# EAGLE schematic Qwiic GPS - Titan X1 (EAGLE 7.7.0)
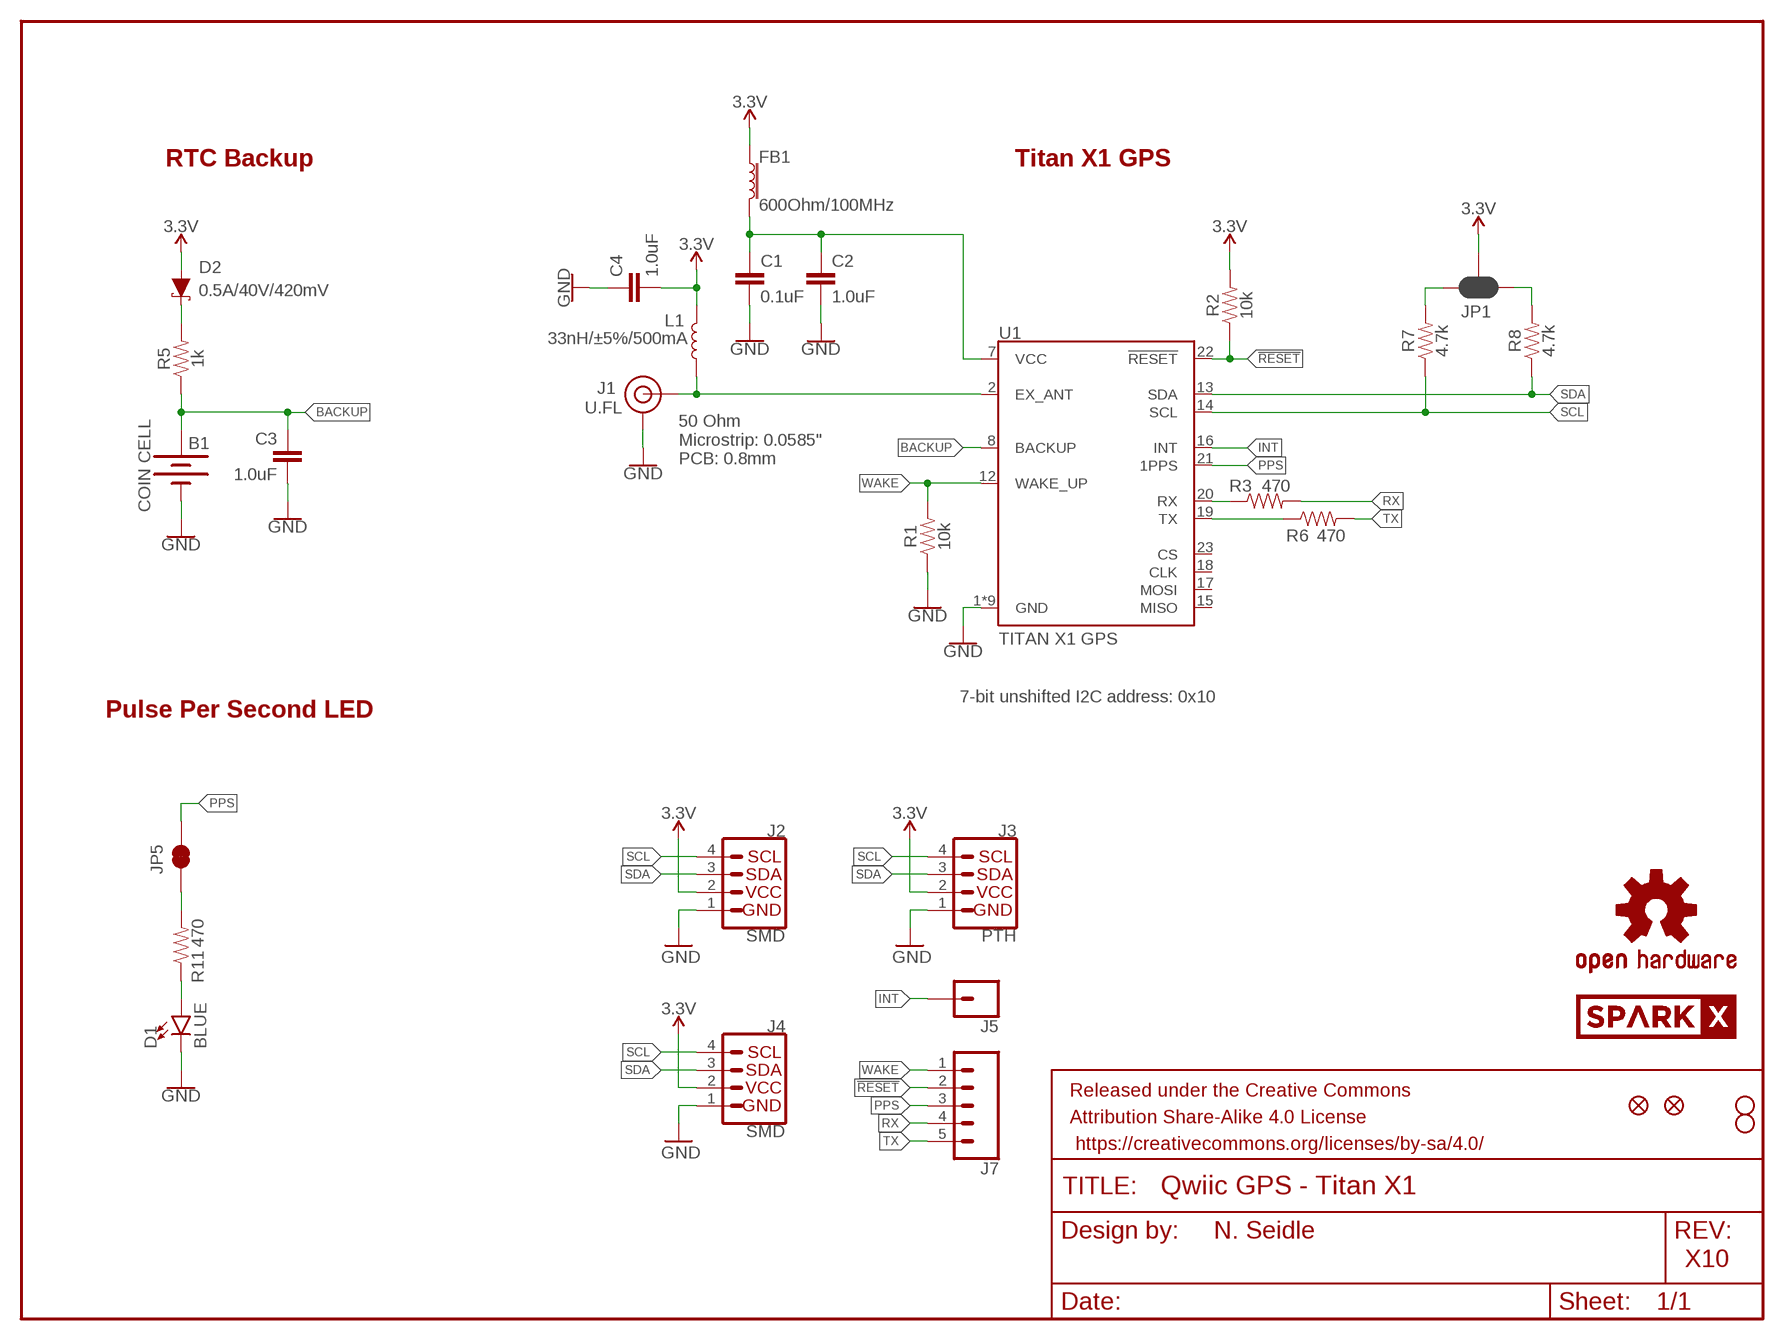
[diagram p0: schematic, sheet 1]

## Parts
B1  COIN CELL  6.8MM_COIN_CELL  [6.8MM_COIN_CELL]
C1  0.1uF  0.1UF-0603-25V-(+80/-20%)  [0603]
C2  1.0uF  1.0UF-0603-16V-10%  [0603]
C3  1.0uF  1.0UF-0603-16V-10%  [0603]
C4  1.0uF  1.0UF-0603-16V-10%  [0603]
D1  BLUE  LED-BLUE0603  [LED-0603]
D2  0.5A/40V/420mV  DIODE-SCHOTTKY-PMEG4005EJ  [SOD-323]
FB1  600Ohm/100MHz  FERRITE_BEAD-0603  [0603]
FRAME1  FRAME-LETTER  [CREATIVE_COMMONS]
J1  U.FL  [U.FL]
J2  SMD  I2C_STANDARDJS-1MM  [1X04_1MM_RA]
J3  PTH  I2C_STANDARD_NO_SILK  [1X04_NO_SILK]
J4  SMD  I2C_STANDARDJS-1MM  [1X04_1MM_RA]
J5  CONN_01PTH_NO_SILK_YES_STOP  [1X01_NO_SILK]
J7  CONN_05NO_SILK  [1X05_NO_SILK]
JP1  JUMPER-SMT_3_2-NC_PASTE_SILK  [SMT-JUMPER_3_2-NC_PASTE_SILK]
JP2  FIDUCIALUFIDUCIAL  [MICRO-FIDUCIAL]
JP3  STAND-OFF  [STAND-OFF]
JP4  STAND-OFF  [STAND-OFF]
JP5  JUMPER-SMT_2_NC_TRACE_NO-SILK  [SMT-JUMPER_2_NC_TRACE_NO-SILK]
JP6  FIDUCIALUFIDUCIAL  [MICRO-FIDUCIAL]
L1  33nH/±5%/500mA  INDUCTOR-0603-33NH  [0603]
LOGO1  OSHW-LOGOMINI  [OSHW-LOGO-MINI]
R1  10k  10KOHM-0603-1/10W-1%  [0603]
R2  10k  10KOHM-0603-1/10W-1%  [0603]
R3  470  470OHM-0603-1/10W-1%  [0603]
R5  1k  1KOHM-0603-1/10W-1%  [0603]
R6  470  470OHM-0603-1/10W-1%  [0603]
R7  4.7k  4.7KOHM-0603-1/10W-1%  [0603]
R8  4.7k  4.7KOHM-0603-1/10W-1%  [0603]
R11  470  470OHM-0603-1/10W-1%  [0603]
U1  TITAN X1 GPS  TITAN_X1_GPS  [TITAN_X1_GPS]
U$1  SPARKX-LOGO5  [SPARKX-LARGE]

## Nets
3.3V: C4.2 D2.A FB1.1 J2.2(VCC) J3.2(VCC) J4.2(VCC) JP1.2 L1.2 R2.2
!RESET: J7.2 R2.1 U1.22(!RESET)
BACKUP: B1.+ C3.1 R5.1 U1.8(BACKUP)
EXT_ANT: J1.FEED(SIGNAL) L1.1 U1.2(EX_ANT)
GND: B1.- C1.2 C2.2 C3.2 C4.1 D1.C J1.1(GND) J1.2(GND) J2.1(GND) J3.1(GND) J4.1(GND) R1.1 U1.1(GND) U1.3(GND) U1.4(GND) U1.5(GND) U1.6(GND) U1.9(GND) U1.10(GND) U1.11(GND) U1.24(GND)
INT: J5.1 U1.16(INT)
N$2: D1.A R11.1
N$4: JP5.1 R11.2
N$5: JP1.1 R8.2
N$6: D2.C R5.2
N$8: JP1.3 R7.2
PPS: J7.3 JP5.2 U1.21(1PPS)
RX: J7.4 R3.2
RXLV: R3.1 U1.20(RX)
SCL: J2.4(SCL) J3.4(SCL) J4.4(SCL) R7.1 U1.14(SCL)
SDA: J2.3(SDA) J3.3(SDA) J4.3(SDA) R8.1 U1.13(SDA)
TX: J7.5 R6.2
TXLV: R6.1 U1.19(TX)
VCC_FILTERED: C1.1 C2.1 FB1.2 U1.7(VCC)
WAKE: J7.1 R1.2 U1.12(WAKE_UP)
Unconnected: U1.15(MISO) U1.17(MOSI) U1.18(CLK) U1.23(CS)

## Notes on the sheet
- RTC Backup | Titan X1 GPS
- 50 Ohm 
  Microstrip: 0.0585"
  PCB: 0.8mm
- 7-bit unshifted I2C address: 0x10
- Pulse Per Second LED
- N. Seidle
- X10

## Library data of the parts
B1 = SparkX:6.8MM_COIN_CELL
C1 = SparkFun-Capacitors:0.1UF: 0.1µF ceramic capacitors A capacitor is a passive two-terminal electrical component used to store electrical energy temporarily in an electric field.; PROD_ID: CAP-00810
C2-C4 = SparkFun-Capacitors:1.0UF: 1µF ceramic capacitors A capacitor is a passive two-terminal electrical component used to store electrical energy temporarily in an electric field.; PROD_ID: CAP-00868
D1 = SparkFun-LED:LED-BLUE: Blue SMD LED Used in manufacturing of various products at SparkFun Packages: 0603 - SMD 0603 package [Product Link] <http://www.digikey.com/product-detail/en/SMLE12BC7TT86/511-1589-2-ND/1641808> 1206 - SMD1206 package [Product Link] <http://www.digikey.com/product-detail/en/lite-on-inc/LTST-C150TBKT/160-1643-1-ND/573584> SparkFun Products: ESP8266 Thing-Dev Board <https://www.sparkfun.com/products/13711> RedBoard <https://www.sparkfun.com/products/12757>; PROD_ID: DIO-08575
D2 = SparkFun-DiscreteSemi:DIODE-SCHOTTKY: Schottky diode A Schottky diode is a semiconductor diode which has a low forward voltage drop and a very fast switching action.; PROD_ID: DIO-10955
FB1 = SparkFun-Coils:FERRITE_BEAD: Ferrite Bead (blocks, cores, rings, chokes, etc.) Inductor with layers of ferrite used to suppress high frequencies. Often used to isolate high frequency noise. SparkFun Products: IOIO-OTG - V2.2 <https://www.sparkfun.com/products/13613> SparkFun SAMD21 Mini Breakout <https://www.sparkfun.com/products/13664> SparkFun 6 Degrees of Freedom Breakout - LSM6DS3 <https://www.sparkfun.com/products/13339> SparkFun SAMD21 Dev Breakout <https://www.sparkfun.com/products/13672>; PROD_ID: NDUC-07859; VALUE: 30Ω/1.8A
FRAME1 = SparkFun-Aesthetics:FRAME-LETTER: Schematic Frame - Letter Standard 8.5x11 US Letter frame
J1 = SparkX:U.FL: SMD Antenna Connector - U.FL 2mm height, 3.0mm x 3.0mm receptacle size. SparkFun Products: SparkFun WiFi Shield - ESP8266 <https://www.sparkfun.com/products/13287> SparkFun ESP8266 Thing <https://www.sparkfun.com/products/13231> SparkFun MiniGen - Pro Mini Signal Generator Shield <https://www.sparkfun.com/products/11420>; PROD_ID: CONN-09193; SF_ID: WRL-09144
J2-J4 = SparkX:I2C_STANDARD: SparkFun I2C Standard Pinout Header SparkFun has standardized on a pinout for all I2C based sensor breakouts. This pinout allows I2C boards to be plugged directly into the headers on Arduino Uno compatible boards, and to be daisy chained easily. Example SparkFun Products: SparkFun Atmospheric Sensor Breakout - BME280 <https://www.sparkfun.com/products/13676> SparkFun Altitude/Pressure Sensor Breakout - MPL3115A2 <https://www.sparkfun.com/products/11084> SparkFun TOF Range Finder Sensor - VL6180 <https://www.sparkfun.com/products/12785>
J5 = SparkFun-Connectors:CONN_01: Single connection point. Often used as Generic Header-pin footprint for 0.1 inch spaced/style header connections On any of the 0.1 inch spaced packages, you can populate with these: Break Away Headers - Straight <https://www.sparkfun.com/products/116> (PRT-00116) Break Away Male Headers - Right Angle <https://www.sparkfun.com/products/553> (PRT-00553) Female Headers <https://www.sparkfun.com/products/115> (PRT-00115) Break Away Headers - Machine Pin <https://www.sparkfun.com/products/117> (PRT-00117) Break Away Female Headers - Swiss Machine Pin <https://www.sparkfun.com/products/743> (PRT-00743) This device is also useful as a general connection point to wire up your design to another part of your project. Our various solder wires solder well into these plated through hole pads. Hook-Up Wire - Assortment (Stranded, 22 AWG) <https://www.sparkfun.com/products/11375> (PRT-11375) Hook-Up Wire - Assortment (Solid Core, 22 AWG) <https://www.sparkfun.com/products/11367> (PRT-11367) View the entire wire category on our website here <https://www.sparkfun.com/categories/141> Special notes: SMTSO-256-ET is a "flush mount" nut for a 4-40 screw. We mostly use this on specialty testbeds; it is a nice way to connect hardware to your PCB at an adjustable hieght. Also note, the SNAP packages are for using a snappable style connector. We sell a baggie of snaps and they are also used on two LilyPad designs: Snap Assortment - 30 pack (male and female) <https://www.sparkfun.com/products/11347> (DEV-11347) LilyPad Arduino SimpleSnap <https://www.sparkfun.com/products/10941> (DEV-10941) LilyPad SimpleSnap Protoboard <https://www.sparkfun.com/products/10940> (DEV-10940)
J7 = SparkFun-Connectors:CONN_05: Multi connection point. Often used as Generic Header-pin footprint for 0.1 inch spaced/style header connections On any of the 0.1 inch spaced packages, you can populate with these: Break Away Headers - Straight <https://www.sparkfun.com/products/116> (PRT-00116) Break Away Male Headers - Right Angle <https://www.sparkfun.com/products/553> (PRT-00553) Female Headers <https://www.sparkfun.com/products/115> (PRT-00115) Break Away Headers - Machine Pin <https://www.sparkfun.com/products/117> (PRT-00117) Break Away Female Headers - Swiss Machine Pin <https://www.sparkfun.com/products/743> (PRT-00743) For SCREWTERMINALS and SPRING TERMINALS visit here: Screw Terimnals on SparkFun.com <https://www.sparkfun.com/search/results?term=Screw+Terminals> (5mm/3.5mm/2.54mm spacing) This device is also useful as a general connection point to wire up your design to another part of your project. Our various solder wires solder well into these plated through hole pads. Hook-Up Wire - Assortment (Stranded, 22 AWG) <https://www.sparkfun.com/products/11375> (PRT-11375) Hook-Up Wire - Assortment (Solid Core, 22 AWG) <https://www.sparkfun.com/products/11367> (PRT-11367) View the entire wire category on our website here <https://www.sparkfun.com/categories/141> Special notes: Molex polarized connector foot print use with SKU : PRT-08231 with associated crimp pins and housings. 1MM SMD Version SKU: PRT-10208
JP1 = SparkFun-Jumpers:JUMPER-SMT_3_2-NC_PASTE: Normally closed solder jumper (2 of 2 connections) This jumper has an aperture in the stencil to allow solder paste to bridge both connections. Both connections are normally closed (NC). Wick off the solder to open the connection(s). Reapply solder to reclose the connection(s).
JP2 JP6 = SparkFun:FIDUCIAL: Fiducial Alignment Points Various fiducial points for machine vision alignment.
JP3 JP4 = SparkFun:STAND-OFF: Stand Off This is the mechanical footprint for a #4 phillips button head screw. Use the keepout ring to avoid running the screw head into surrounding components. SKU : PRT-00447
JP5 = SparkFun-Jumpers:JUMPER-SMT_2_NC_TRACE: Normally closed trace jumper This jumper has a trace between two pads so it's normally closed (NC). Use a razor knife to open the connection. For best results follow the IPC guidelines for cutting traces: Cutout at least 0.063 mm (0.005 in). Remove all loose material to clean up the cut area. Seal the cut with an approved epoxy. Reapply solder to reclose the connection.
L1 = SparkFun-Coils:INDUCTOR: Inductors Resist changes in electrical current. Basically a coil of wire. SparkFun Products: SparkFun Load Cell Amplifier - HX711 <https://www.sparkfun.com/products/13879> IOIO-OTG - V2.2 <https://www.sparkfun.com/products/13613>; PROD_ID: NDUC-07874
LOGO1 = SparkFun-Aesthetics:OSHW-LOGO: Open-Source Hardware (OSHW) Logo This logo indicates the piece of hardware it is found on incorporates a OSHW license and/or adheres to the definition of open source hardware found here: http://freedomdefined.org/OSHW
R1 R2 = SparkFun-Resistors:10KOHM: 10kΩ resistor A resistor is a passive two-terminal electrical component that implements electrical resistance as a circuit element. Resistors act to reduce current flow, and, at the same time, act to lower voltage levels within circuits. - Wikipedia; PROD_ID: RES-00824
R3 R6 R11 = SparkFun-Resistors:470OHM: 470Ω resistor A resistor is a passive two-terminal electrical component that implements electrical resistance as a circuit element. Resistors act to reduce current flow, and, at the same time, act to lower voltage levels within circuits. - Wikipedia; PROD_ID: RES-07869
R5 = SparkFun-Resistors:1KOHM: 1kΩ resistor A resistor is a passive two-terminal electrical component that implements electrical resistance as a circuit element. Resistors act to reduce current flow, and, at the same time, act to lower voltage levels within circuits. - Wikipedia; PROD_ID: RES-07856
R7 R8 = SparkFun-Resistors:4.7KOHM: 4.7kΩ resistor A resistor is a passive two-terminal electrical component that implements electrical resistance as a circuit element. Resistors act to reduce current flow, and, at the same time, act to lower voltage levels within circuits. - Wikipedia; PROD_ID: RES-07857
U1 = SparkX:TITAN_X1_GPS
U$1 = SparkX:SPARKX-LOGO